# Altium schematic sheet INA190.SchDoc
size A4; SheetNumber: 8; SheetTotal: 8
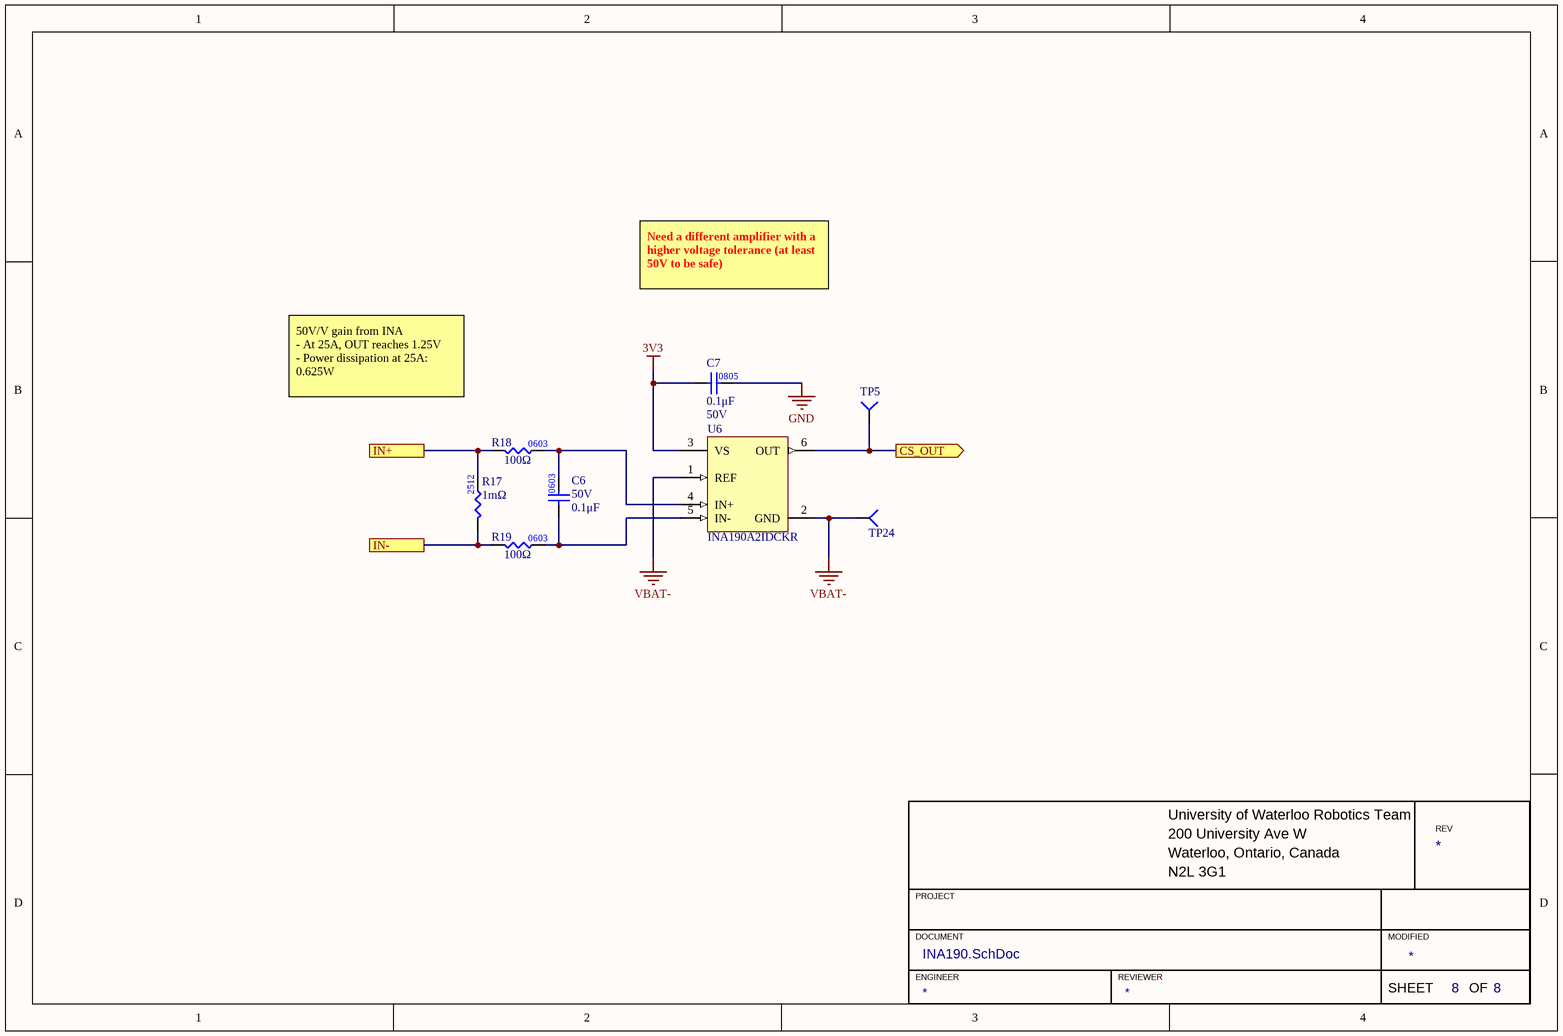
[diagram p0: INA190.SchDoc]

## Parts
C6  value 0.1μF  Voltage Rating: 50V  [CAP0603]  (hidden comment: CAP_0.1uF_50V_0603)
C7  value 0.1μF  Voltage Rating: 50V  [CAP0805]  (hidden comment: CAP_0.1uF_50V_0805)
R17  value 1mΩ  [RESC6532X75N]  (hidden comment: RES_1mΩ_2512_1%)
R18  value 100Ω  [RES0603]  (hidden comment: RES_100Ω_0603_1%)
R19  value 100Ω  [RES0603]  (hidden comment: RES_100Ω_0603_1%)
TP5  TESTPOINT_1MM_CIRCLE  [TESTPOINT_CIRCLE_1MM]  (value not drawn)  (no BOM)
TP24  TESTPOINT_SMD_LOOP  [S1751-46R]  (value not drawn)
U6  INA190A2IDCKR  [TI_SC-70-6]

## Ports
CS_OUT (out), IN+, IN-

## Nets
3V3: C7.1 U6.3(VS)
GND: C7.2
VBAT-: TP24.1(=value) U6.1(REF) U6.2(GND)
CS_OUT: TP5.1(=value) U6.6(OUT) ; port CS_OUT
IN+: R17.2 R18.1 ; port IN+
IN-: R17.1 R19.1 ; port IN-
NetC6_1: C6.1 R19.2 U6.5(IN-)
NetC6_2: C6.2 R18.2 U6.4(IN+)

## Notes on the sheet
- Need a different amplifier with a higher voltage tolerance (at least 50V to be safe)
- 50V/V gain from INA
  - At 25A, OUT reaches 1.25V
  - Power dissipation at 25A: 0.625W
- University of Waterloo Robotics Team
- 200 University Ave W
- REV
- PROJECT
- Waterloo, Ontario, Canada
- N2L 3G1
- DOCUMENT
- ENGINEER
- REVIEWER
- MODIFIED
- SHEET
- OF
- (in symbol RES_100Ω_0603_1%) 0603

## Library data of the parts
C6 = CAP_0.1uF_50V_0603: CAP CER 0.1UF 50V X7R 0603; Manufacturer Part Number 1: CC0603KRX7R9BB104; Manufacturer 1: Yageo; Package/Footprint: 0603; Supplier Part Number 1: 311-1344-1-ND; Supplier 1: Digi-Key; Mounting Type: SMD; Dielectric: X7R
C7 = CAP_0.1uF_50V_0805: CAP CER 0.1UF 50V X7R 0805; Manufacturer 1: Murata Electronics; Manufacturer Part Number 1: GCM21BR71H104KA37K; Package/Footprint: 0805; Supplier 1: Digi-Key; Supplier Part Number 1: 490-8049-1-ND; Mounting Type: SMD; Dielectric: X7R; LCSC Part #: C49678
R17 = RES_1mΩ_2512_1%: RES 1 mOHM 1% 3W 2512; Manufacturer 1: Riedon; Manufacturer Part Number 1: CSRL3-0R001F8; Supplier 1: Digi-Key; Supplier Part Number 1: 696-1834-1-ND; Mounting Type: SMD; Package: 2512
R18 R19 = RES_100Ω_0603_1%: RES 100 OHM 1% 1/10W 0603; Manufacturer 1: Yageo; Manufacturer Part Number 1: RC0603FR-07100RL; Supplier Part Number 1: 311-100HRCT-ND; Supplier 1: Digi-Key
TP5 = TESTPOINT_1MM_CIRCLE: TESTPOINT 1MM CIRCLE
TP24 = TESTPOINT_SMD_LOOP: TESTPOINT SMD LOOP; Manufacturer 1: Harwin; Supplier 1: Digi-Key; Manufacturer Part Number 1: S1751-46R; Mounting Type: SMD; Package/Footprint: SMD; Supplier Part Number 1: 952-1478-1-ND
U6 = INA190A2IDCKR: IC CURR SENSE 1 CIRCUIT SC70-6; Manufacturer 1: Texas Instruments; Package/Footprint: 6-TSSOP; Supplier 1: Digi-Key; Supplier Part Number 1: 296-INA190A2IDCKRCT-ND; Manufacturer Part Number 1: INA190A2IDCKR